# Altium project Q7.PrjPcb
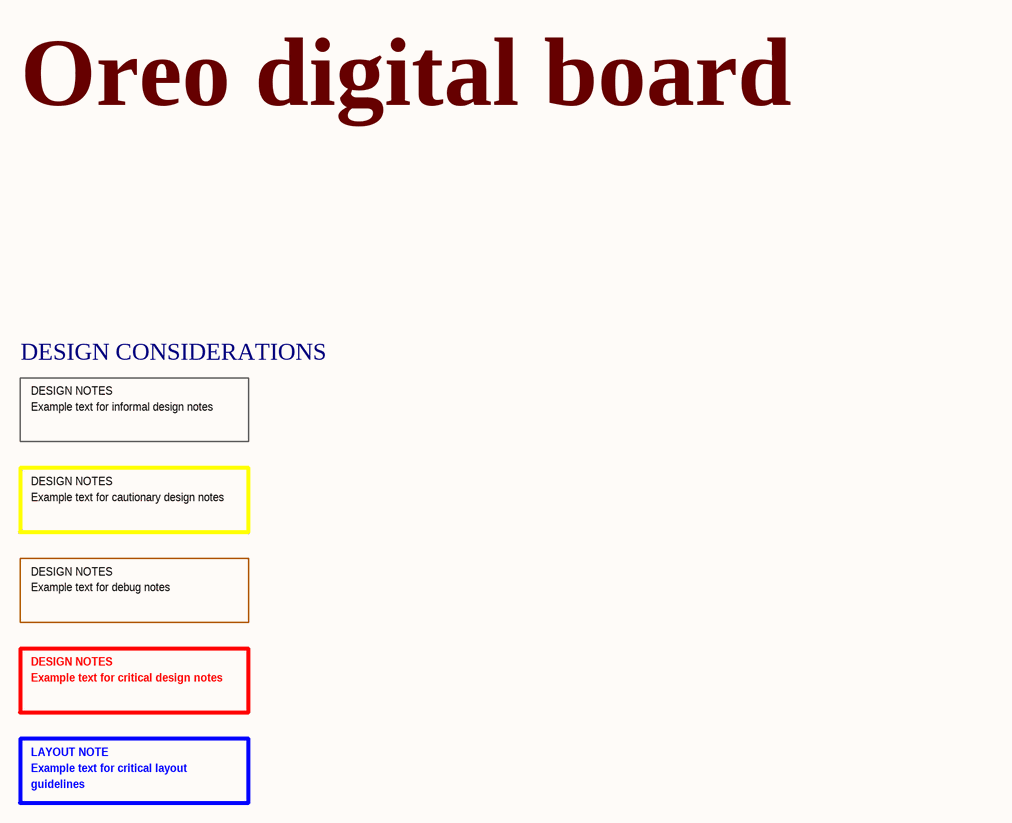
[diagram p0: [01] - COVER PAGE.SchDoc]
9 sheets, 124 parts. Net scope: flat (ports and power ports of the same name join across sheets).
Board file: Q7.PcbDoc
Sheets:
  [01] - COVER PAGE.SchDoc
  [02] - CPU - IO.SchDoc
  [03] - CPU - SIGNAL, USB, JTAG.SchDoc
  [04] - CPU - POWER.SchDoc
  [05] - AUDIO.SchDoc
  [06] - BUTTONS - LEDS.SchDoc
  [07] - POWER.SchDoc
  [08] - CONNECTORS.SchDoc
  [09] - FTDI.SchDoc

## Sheet [01] - COVER PAGE.SchDoc: COVER PAGE
size A4; Organization: Bjørn Brodtkorb; Address1: Frode Rinnans veg 161; Address2: 7050 Trondheim; DocumentNumber: 6598; Revision: 1.0; SheetNumber: 1; SheetTotal: 1

### Notes on the sheet
- Oreo digital board
- DESIGN CONSIDERATIONS
- DESIGN NOTES
- Example text for informal design notes
- Example text for cautionary design notes
- Example text for debug notes
- Example text for critical design notes
- LAYOUT NOTE
- Example text for critical layout
- guidelines
- Title
- Size:
- Date:
- A4
- Number:
- Time:
- Revision:
- Sheet
- of
- File:

## Sheet [02] - CPU - IO.SchDoc: Project
size A4; Organization: Tor Brodtkorb; Address1: Frode Rinnans veg 193; Address2: 7050 Trondheim; DocumentNumber: 6598; Revision: 1.0; SheetNumber: 1; SheetTotal: 1
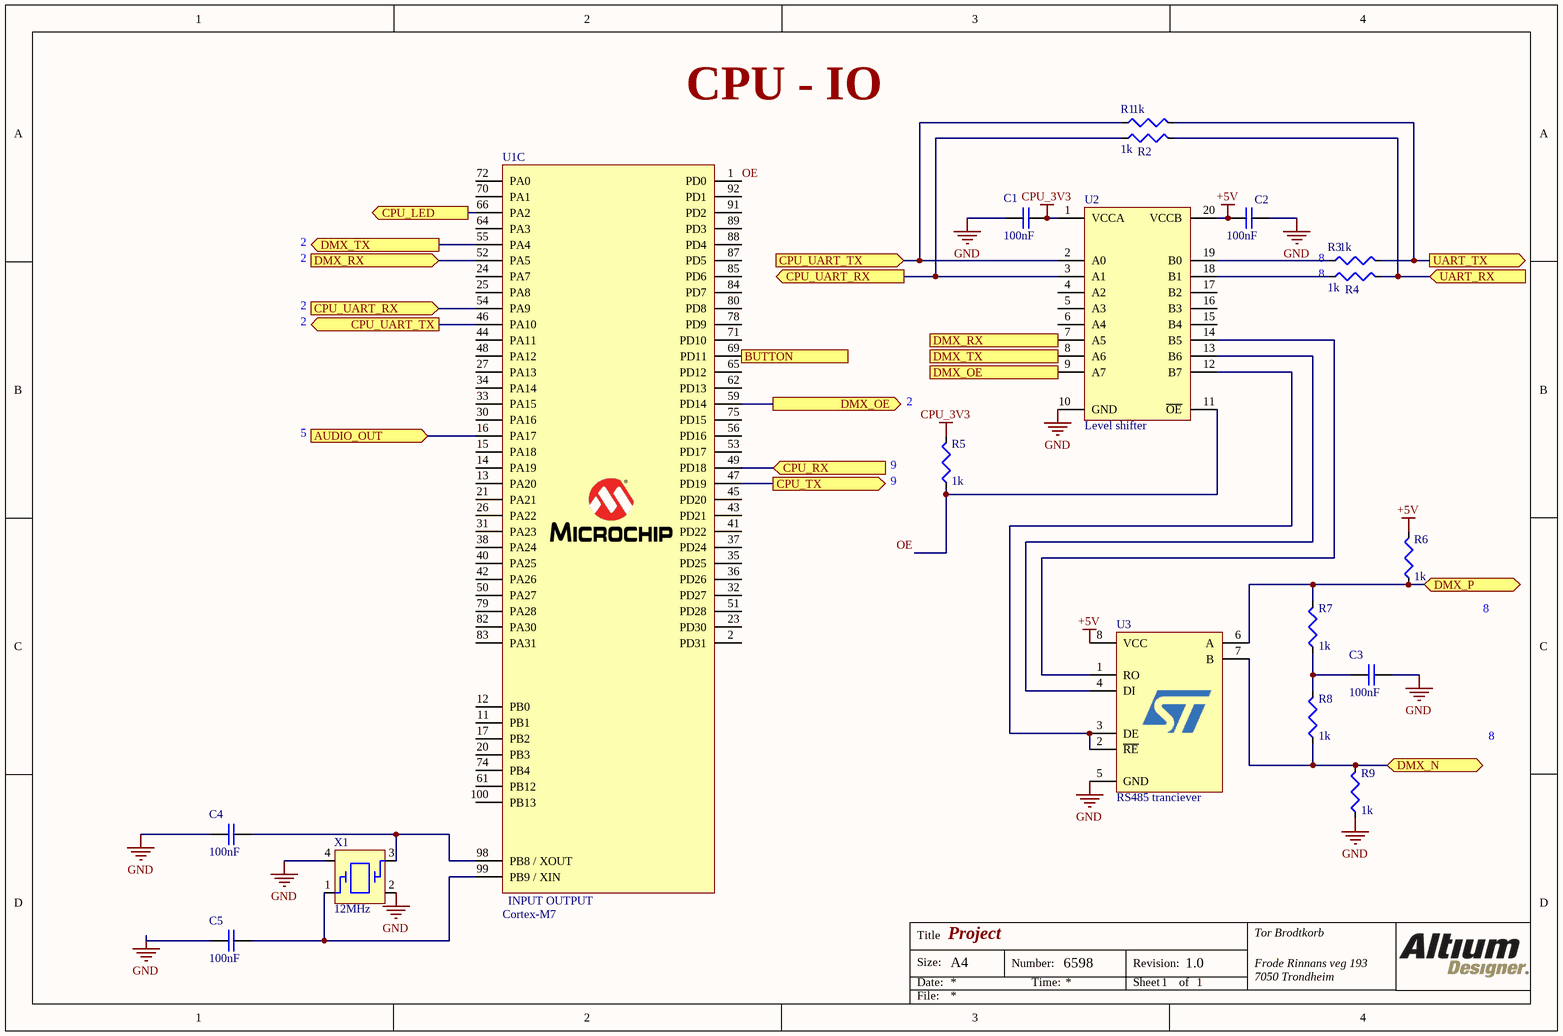
[diagram p1: [02] - CPU - IO.SchDoc]

### Parts
C1  value 100nF  [C0603]  (hidden comment: 02016D104KAT2A)
C2  value 100nF  [C0603]  (hidden comment: 02016D104KAT2A)
C3  value 100nF  [C0603]  (hidden comment: 02016D104KAT2A)
C4  value 100nF  [C0603]  (hidden comment: 02016D104KAT2A)
C5  value 100nF  [C0603]  (hidden comment: 02016D104KAT2A)
R1  value 1k  [R0603]  (hidden comment: CPF-A-0603B100KE1)
R2  value 1k  [R0603]  (hidden comment: CPF-A-0603B100KE1)
R3  value 1k  [R0603]  (hidden comment: CPF-A-0603B100KE1)
R4  value 1k  [R0603]  (hidden comment: CPF-A-0603B100KE1)
R5  value 1k  [R0603]  (hidden comment: CPF-A-0603B100KE1)
R6  value 1k  [R0603]  (hidden comment: CPF-A-0603B100KE1)
R7  value 1k  [R0603]  (hidden comment: CPF-A-0603B100KE1)
R8  value 1k  [R0603]  (hidden comment: CPF-A-0603B100KE1)
R9  value 1k  [R0603]  (hidden comment: CPF-A-0603B100KE1)
U1  Cortex-M7  [ATSAMS70N19A-AN]  (part C of 3)
U2  Level shifter  [FXMA108BQX]
U3  RS485 tranciever  [ST485CDR]
X1  12MHz  [MCSJK-7U-12.00-12-30-80-B-30]

### Ports
AUDIO_OUT (in), BUTTON (in), CPU_LED (out), CPU_RX (in), CPU_TX (out), CPU_UART_RX (in), CPU_UART_RX (out), CPU_UART_TX (in), CPU_UART_TX (out), DMX_N (bidir), DMX_OE (in), DMX_OE (out), DMX_P (bidir), DMX_RX (in), DMX_RX (out), DMX_TX (in), DMX_TX (out), UART_RX (in), UART_TX (out)

### Nets
+5V: C2.2 R6.2 U2.20(VCCB) U3.8(VCC)
CPU_3V3: C1.2 R5.2 U2.1(VCCA)  [project net +3V3]
GND: C1.1 C2.1 C3.1 C4.1 C5.1 R9.1 U2.10(GND) U3.5(GND) X1.2 X1.4
OE: R5.1 U1.1(PD0) U2.11(~{OE})
NetC3_2: C3.2 R7.1 R8.2
NetC4_2: C4.2 U1.98(PB8_/_XOUT) X1.3
NetC5_2: C5.2 U1.99(PB9_/_XIN) X1.1
NetC49_2: U1.16(PA17) ; port AUDIO_OUT
NetJ5_1: R6.1 R7.2 U3.6(A) ; port DMX_P
NetJ5_2: R8.1 R9.2 U3.7(B) ; port DMX_N
NetJ6_1: R1.2 R3.2 ; port UART_TX
NetJ6_2: R2.2 R4.2 ; port UART_RX
NetR1_1: R1.1 U1.46(PA10) U2.2(A0) ; port CPU_UART_TX
NetR2_1: R2.1 U1.54(PA9) U2.3(A1) ; port CPU_UART_RX
NetR3_1: R3.1 U2.19(B0)
NetR4_1: R4.1 U2.18(B1)
NetR25_1: U1.66(PA2) ; port CPU_LED
NetSW1_1: U1.69(PD11) ; port BUTTON
NetU1_47: U1.47(PD19) ; port CPU_TX
NetU1_49: U1.49(PD18) ; port CPU_RX
NetU1_52: U1.52(PA5) U2.7(A5) ; port DMX_RX
NetU1_55: U1.55(PA4) U2.8(A6) ; port DMX_TX
NetU1_59: U1.59(PD14) U2.9(A7) ; port DMX_OE
NetU2_12: U2.12(B7) U3.2(~{RE}) U3.3(DE)
NetU2_13: U2.13(B6) U3.4(DI)
NetU2_14: U2.14(B5) U3.1(RO)

Not connected (* = marked no-connect by the designer): U1 2(PD31) 11(PB1) 12(PB0) 13(PA20) 14(PA19) 15(PA18) 17(PB2) 20(PB3) 21(PA21) 23(PD30) 24(PA7) 25(PA8) 26(PA22) 27(PA13) 30(PA16) 31(PA23) 32(PD27) 33(PA15) 34(PA14) 35(PD25) 36(PD26) 37(PD24) 38(PA24) 40(PA25) 41(PD22) 42(PA26) 43(PD21) 44(PA11) 45(PD20) 48(PA12) 50(PA27) 51(PD28) 53(PD17) 56(PD16) 61(PB12) 62(PD13) 64(PA3) 65(PD12) 70(PA1) 71(PD10) 72(PA0) 74(PB4) 75(PD15) 78(PD9) 79(PA28) 80(PD8) 82(PA30) 83(PA31) 84(PD7) 85(PD6) 87(PD5) 88(PD4) 89(PD3) 91(PD2) 92(PD1) 100(PB13); U2 4(A2) 5(A3) 6(A4) 15(B4) 16(B3) 17(B2)

### Notes on the sheet
- CPU - IO
- 2
- (near R3) 8
- 8
- 5
- (near R5) 2
- (near R5) 9
- Title
- Size:
- Date:
- A4
- Number:
- Time:
- Revision:
- Sheet
- of
- File:
- (in symbol ATSAMS70N19A-AN, part C) INPUT OUTPUT

### Library data of the parts
C1-C5 = 02016D104KAT2A: C0603
R1-R9 = CPF-A-0603B100KE1: R0603
U1 = ATSAMS70N19A-AN: ATSAMS70N19
U2 = FXMA108BQX: 8-bit bidirectional level shifter
U3 = ST485CDR
X1 = MCSJK-7U-12.00-12-30-80-B-30: Crystal 12MHz 3.2mm x 2.5mm

## Sheet [03] - CPU - SIGNAL, USB, JTAG.SchDoc: Project
size A4; Organization: Tor Brodtkorb; Address1: Frode Rinnans veg 193; Address2: 7050 Trondheim; DocumentNumber: 6598; Revision: 1.0; SheetNumber: 1; SheetTotal: 1
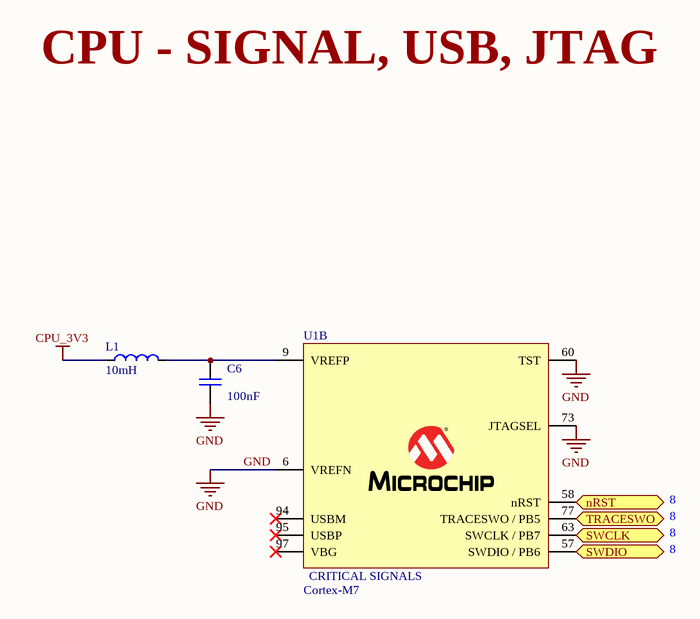
[diagram p2: [03] - CPU - SIGNAL, USB, JTAG.SchDoc]

### Parts
C6  value 100nF  [C0603]  (hidden comment: 02016D104KAT2A)
L1  value 10mH  [Inductor 0603]  (hidden comment: MLZ1608A2R2WT)
U1  Cortex-M7  [ATSAMS70N19A-AN]  (part B of 3)

### Ports
nRST (bidir), SWCLK (bidir), SWDIO (bidir), TRACESWO (bidir)

### Nets
CPU_3V3: L1.1  [project net +3V3]
GND: C6.1 U1.6(VREFN) U1.60(TST) U1.73(JTAGSEL)
NetC6_2: C6.2 L1.2 U1.9(VREFP)
NetJ7_2: U1.58(nRST) ; port nRST
NetJ7_6: U1.77(TRACESWO_/_PB5) ; port TRACESWO
NetJ7_8: U1.63(SWCLK_/_PB7) ; port SWCLK
NetJ7_10: U1.57(SWDIO_/_PB6) ; port SWDIO

Not connected (* = marked no-connect by the designer): U1 94(USBM)* 95(USBP)* 97(VBG)*

### Notes on the sheet
- CPU - SIGNAL, USB, JTAG
- 8
- Title
- Size:
- Date:
- A4
- Number:
- Time:
- Revision:
- Sheet
- of
- File:
- (in symbol ATSAMS70N19A-AN, part B) CRITICAL SIGNALS

### Library data of the parts
C6 = 02016D104KAT2A: C0603
L1 = MLZ1608A2R2WT: Inductor 0603
U1 = ATSAMS70N19A-AN: ATSAMS70N19

## Sheet [04] - CPU - POWER.SchDoc: Project
size A4; Organization: Tor Brodtkorb; Address1: Frode Rinnans veg 193; Address2: 7050 Trondheim; DocumentNumber: 6598; Revision: 1.0; SheetNumber: 1; SheetTotal: 1
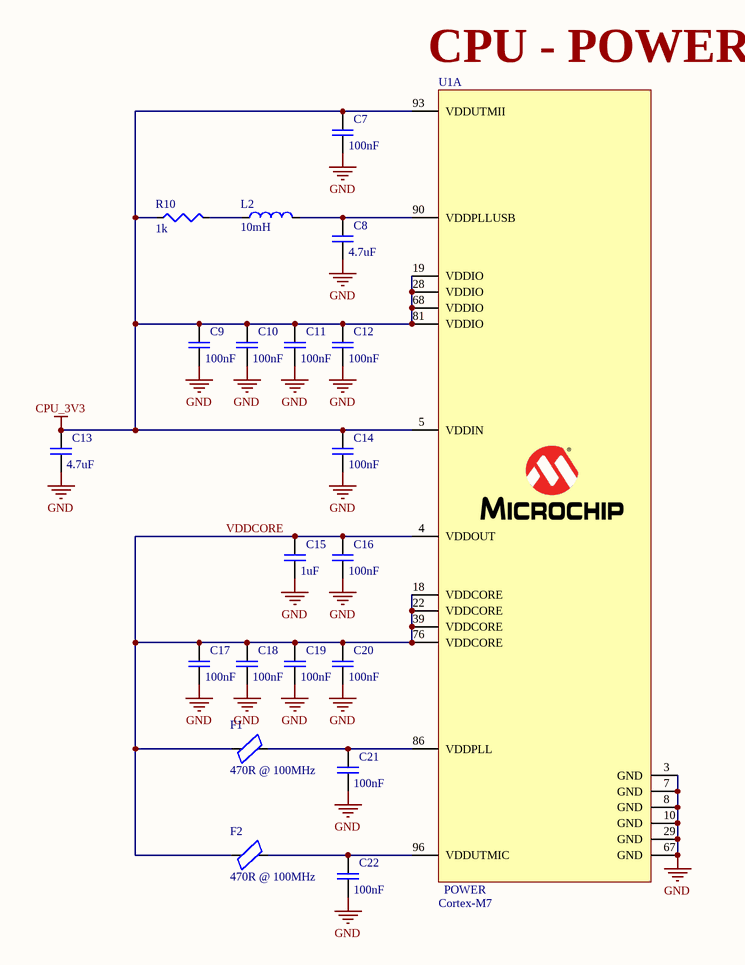
[diagram p3: [04] - CPU - POWER.SchDoc]

### Parts
C7  value 100nF  [C0603]  (hidden comment: 02016D104KAT2A)
C8  value 4.7uF  [C0603]  (hidden comment: 02016D104KAT2A)
C9  value 100nF  [C0603]  (hidden comment: 02016D104KAT2A)
C10  value 100nF  [C0603]  (hidden comment: 02016D104KAT2A)
C11  value 100nF  [C0603]  (hidden comment: 02016D104KAT2A)
C12  value 100nF  [C0603]  (hidden comment: 02016D104KAT2A)
C13  value 4.7uF  [C0603]  (hidden comment: 02016D104KAT2A)
C14  value 100nF  [C0603]  (hidden comment: 02016D104KAT2A)
C15  value 1uF  [C0603]  (hidden comment: 02016D104KAT2A)
C16  value 100nF  [C0603]  (hidden comment: 02016D104KAT2A)
C17  value 100nF  [C0603]  (hidden comment: 02016D104KAT2A)
C18  value 100nF  [C0603]  (hidden comment: 02016D104KAT2A)
C19  value 100nF  [C0603]  (hidden comment: 02016D104KAT2A)
C20  value 100nF  [C0603]  (hidden comment: 02016D104KAT2A)
C21  value 100nF  [C0603]  (hidden comment: 02016D104KAT2A)
C22  value 100nF  [C0603]  (hidden comment: 02016D104KAT2A)
F1  value 470R @ 100MHz  [Ferrite bead 0603]  (hidden comment: BLM18AG121SN1D)
F2  value 470R @ 100MHz  [Ferrite bead 0603]  (hidden comment: BLM18AG121SN1D)
L2  value 10mH  [Inductor 0603]  (hidden comment: MLZ1608A2R2WT)
R10  value 1k  [R0603]  (hidden comment: CPF-A-0603B100KE1)
U1  Cortex-M7  [ATSAMS70N19A-AN]  (part A of 3)

### Nets
CPU_3V3: C7.2 C9.2 C10.2 C11.2 C12.2 C13.2 C14.2 R10.1 U1.5(VDDIN) U1.19(VDDIO) U1.28(VDDIO) U1.68(VDDIO) U1.81(VDDIO) U1.93(VDDUTMII)  [project net +3V3]
GND: C7.1 C8.1 C9.1 C10.1 C11.1 C12.1 C13.1 C14.1 C15.1 C16.1 C17.1 C18.1 C19.1 C20.1 C21.1 C22.1 U1.3(GND) U1.7(GND) U1.8(GND) U1.10(GND) U1.29(GND) U1.67(GND)
VDDCORE: C15.2 C16.2 C17.2 C18.2 C19.2 C20.2 F1.1 F2.1 U1.4(VDDOUT) U1.18(VDDCORE) U1.22(VDDCORE) U1.39(VDDCORE) U1.76(VDDCORE)
NetC8_2: C8.2 L2.2 U1.90(VDDPLLUSB)
NetC21_2: C21.2 F1.2 U1.86(VDDPLL)
NetC22_2: C22.2 F2.2 U1.96(VDDUTMIC)
NetL2_1: L2.1 R10.2

### Notes on the sheet
- (near U1) CPU - POWER
- Title
- Size:
- Date:
- A4
- Number:
- Time:
- Revision:
- Sheet
- of
- File:
- (in symbol ATSAMS70N19A-AN, part A) POWER

### Library data of the parts
C7-C22 = 02016D104KAT2A: C0603
F1 F2 = BLM18AG121SN1D: Ferrite bead 0603
L2 = MLZ1608A2R2WT: Inductor 0603
R10 = CPF-A-0603B100KE1: R0603
U1 = ATSAMS70N19A-AN: ATSAMS70N19

## Sheet [05] - AUDIO.SchDoc: Project
size A4; Organization: Tor Brodtkorb; Address1: Frode Rinnans veg 193; Address2: 7050 Trondheim; DocumentNumber: 6598; Revision: 1.0; SheetNumber: 1; SheetTotal: 1
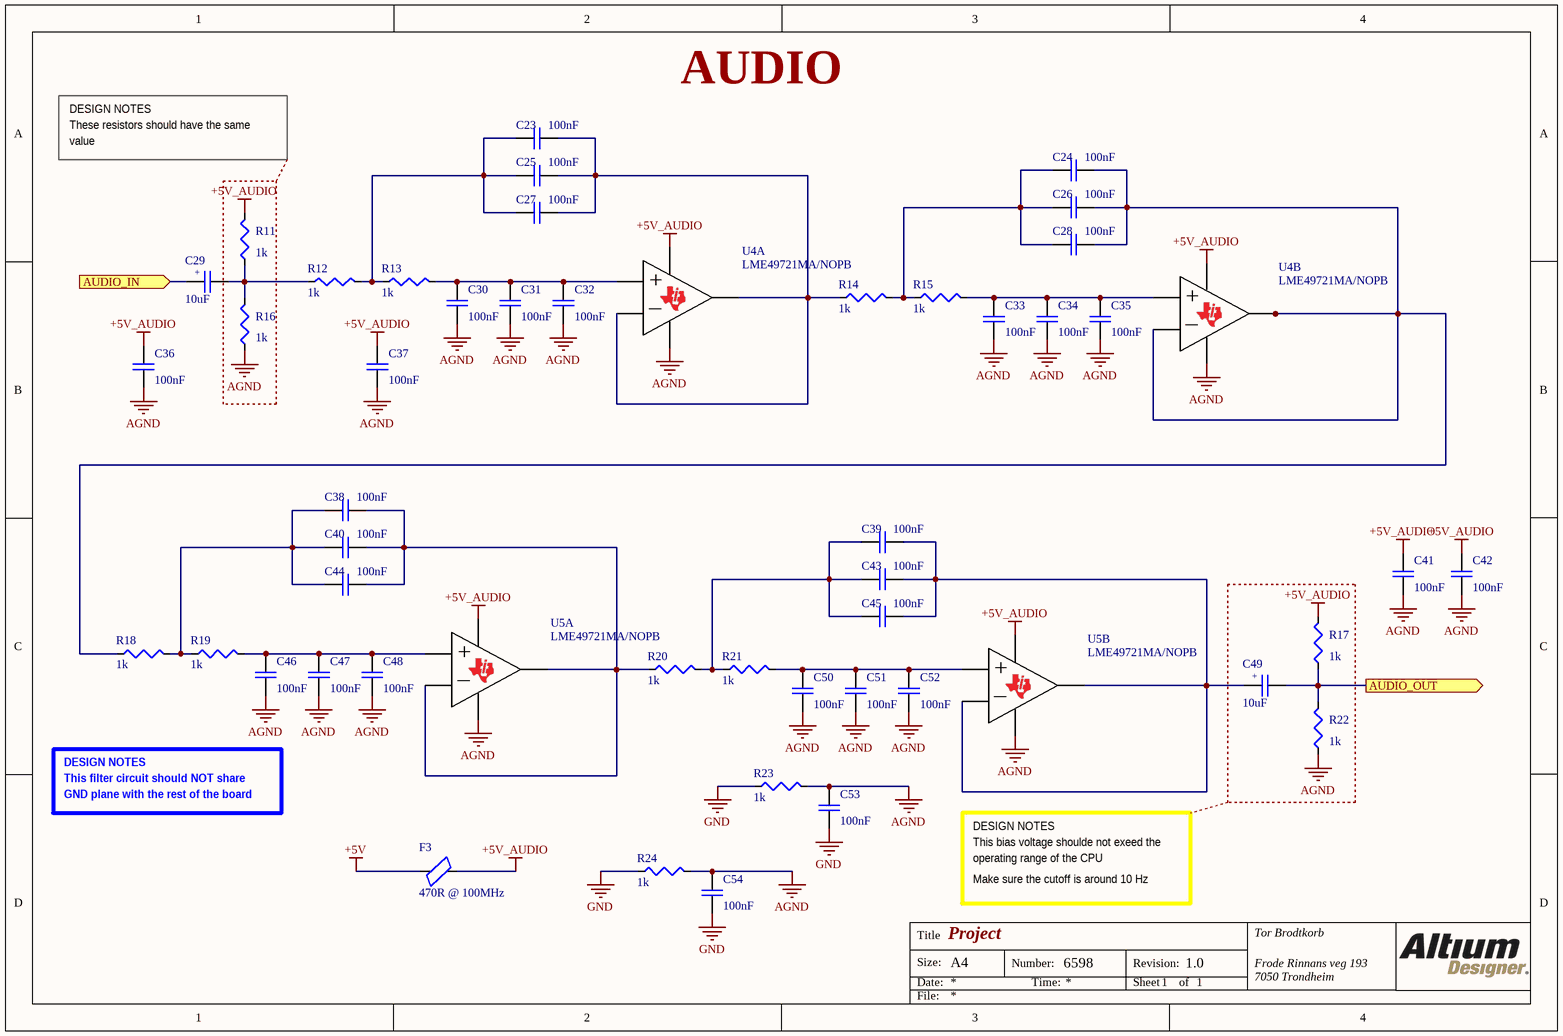
[diagram p4: [05] - AUDIO.SchDoc]

### Parts
C23  value 100nF  [C0603]  (hidden comment: 02016D104KAT2A)
C24  value 100nF  [C0603]  (hidden comment: 02016D104KAT2A)
C25  value 100nF  [C0603]  (hidden comment: 02016D104KAT2A)
C26  value 100nF  [C0603]  (hidden comment: 02016D104KAT2A)
C27  value 100nF  [C0603]  (hidden comment: 02016D104KAT2A)
C28  value 100nF  [C0603]  (hidden comment: 02016D104KAT2A)
C29  value 10uF  [Capacitor electrolytic SMD 4x5.4]  (hidden comment: EEE1HA2R2SR)
C30  value 100nF  [C0603]  (hidden comment: 02016D104KAT2A)
C31  value 100nF  [C0603]  (hidden comment: 02016D104KAT2A)
C32  value 100nF  [C0603]  (hidden comment: 02016D104KAT2A)
C33  value 100nF  [C0603]  (hidden comment: 02016D104KAT2A)
C34  value 100nF  [C0603]  (hidden comment: 02016D104KAT2A)
C35  value 100nF  [C0603]  (hidden comment: 02016D104KAT2A)
C36  value 100nF  [C0603]  (hidden comment: 02016D104KAT2A)
C37  value 100nF  [C0603]  (hidden comment: 02016D104KAT2A)
C38  value 100nF  [C0603]  (hidden comment: 02016D104KAT2A)
C39  value 100nF  [C0603]  (hidden comment: 02016D104KAT2A)
C40  value 100nF  [C0603]  (hidden comment: 02016D104KAT2A)
C41  value 100nF  [C0603]  (hidden comment: 02016D104KAT2A)
C42  value 100nF  [C0603]  (hidden comment: 02016D104KAT2A)
C43  value 100nF  [C0603]  (hidden comment: 02016D104KAT2A)
C44  value 100nF  [C0603]  (hidden comment: 02016D104KAT2A)
C45  value 100nF  [C0603]  (hidden comment: 02016D104KAT2A)
C46  value 100nF  [C0603]  (hidden comment: 02016D104KAT2A)
C47  value 100nF  [C0603]  (hidden comment: 02016D104KAT2A)
C48  value 100nF  [C0603]  (hidden comment: 02016D104KAT2A)
C49  value 10uF  [Capacitor electrolytic SMD 4x5.4]  (hidden comment: EEE1HA2R2SR)
C50  value 100nF  [C0603]  (hidden comment: 02016D104KAT2A)
C51  value 100nF  [C0603]  (hidden comment: 02016D104KAT2A)
C52  value 100nF  [C0603]  (hidden comment: 02016D104KAT2A)
C53  value 100nF  [C0603]  (hidden comment: 02016D104KAT2A)
C54  value 100nF  [C0603]  (hidden comment: 02016D104KAT2A)
F3  value 470R @ 100MHz  [Ferrite bead 0603]  (hidden comment: BLM18AG121SN1D)
R11  value 1k  [R0603]  (hidden comment: CPF-A-0603B100KE1)
R12  value 1k  [R0603]  (hidden comment: CPF-A-0603B100KE1)
R13  value 1k  [R0603]  (hidden comment: CPF-A-0603B100KE1)
R14  value 1k  [R0603]  (hidden comment: CPF-A-0603B100KE1)
R15  value 1k  [R0603]  (hidden comment: CPF-A-0603B100KE1)
R16  value 1k  [R0603]  (hidden comment: CPF-A-0603B100KE1)
R17  value 1k  [R0603]  (hidden comment: CPF-A-0603B100KE1)
R18  value 1k  [R0603]  (hidden comment: CPF-A-0603B100KE1)
R19  value 1k  [R0603]  (hidden comment: CPF-A-0603B100KE1)
R20  value 1k  [R0603]  (hidden comment: CPF-A-0603B100KE1)
R21  value 1k  [R0603]  (hidden comment: CPF-A-0603B100KE1)
R22  value 1k  [R0603]  (hidden comment: CPF-A-0603B100KE1)
R23  value 1k  [R0603]  (hidden comment: CPF-A-0603B100KE1)
R24  value 1k  [R0603]  (hidden comment: CPF-A-0603B100KE1)
U4  LME49721MA/NOPB  [LME49721MA/NOPB]  (parts A,B of 2)
U5  LME49721MA/NOPB  [LME49721MA/NOPB]  (parts A,B of 2)

### Ports
AUDIO_IN (in), AUDIO_OUT (out)

### Nets
+5V: F3.1
+5V_AUDIO: C36.2 C37.2 C41.2 C42.2 F3.2 R11.2 R17.2 U4.8(VDD) U5.8(VDD)
AGND: C30.1 C31.1 C32.1 C33.1 C34.1 C35.1 C36.1 C37.1 C41.1 C42.1 C46.1 C47.1 C48.1 C50.1 C51.1 C52.1 C53.2 C54.2 R16.1 R22.1 R23.2 R24.2 U4.4(VDD) U5.4(VDD)
GND: C53.1 C54.1 R23.1 R24.1
NetC23_1: C23.1 C25.1 C27.1 R12.2 R13.1
NetC23_2: C23.2 C25.2 C27.2 R14.1 U4.1(VDD) U4.2(VDD)
NetC24_1: C24.1 C26.1 C28.1 R14.2 R15.1
NetC24_2: C24.2 C26.2 C28.2 R18.1 U4.6(VDD) U4.7(VDD)
NetC29_1: C29.1 ; port AUDIO_IN
NetC29_2: C29.2 R11.1 R12.1 R16.2
NetC30_2: C30.2 C31.2 C32.2 R13.2 U4.3(VDD)
NetC33_2: C33.2 C34.2 C35.2 R15.2 U4.5(VDD)
NetC38_1: C38.1 C40.1 C44.1 R18.2 R19.1
NetC38_2: C38.2 C40.2 C44.2 R20.1 U5.1(VDD) U5.2(VDD)
NetC39_1: C39.1 C43.1 C45.1 R20.2 R21.1
NetC39_2: C39.2 C43.2 C45.2 C49.1 U5.6(VDD) U5.7(VDD)
NetC46_2: C46.2 C47.2 C48.2 R19.2 U5.3(VDD)
NetC49_2: C49.2 R17.1 R22.2 ; port AUDIO_OUT
NetC50_2: C50.2 C51.2 C52.2 R21.2 U5.5(VDD)

### Notes on the sheet
- DESIGN NOTES
- AUDIO
- These resistors should have the same
- value
- This filter circuit should NOT share
- GND plane with the rest of the board
- This bias voltage shoulde not exeed the
- operating range of the CPU
- Make sure the cutoff is around 10 Hz
- Title
- Size:
- Date:
- A4
- Number:
- Time:
- Revision:
- Sheet
- of
- File:
- (in symbol EEE1HA2R2SR) +
- (in symbol LME49721MA/NOPB, part A) +; _
- (in symbol LME49721MA/NOPB, part B) +; _

### Library data of the parts
C23-C28 C30-C48 C50-C54 = 02016D104KAT2A: C0603
C29 C49 = EEE1HA2R2SR: El. Capacitor SMD 4x5.4
F3 = BLM18AG121SN1D: Ferrite bead 0603
R11-R24 = CPF-A-0603B100KE1: R0603
U4 U5 = LME49721MA/NOPB: Audio OP amp, single supply, low voltage

## Sheet [06] - BUTTONS - LEDS.SchDoc: Project
size A4; Organization: Tor Brodtkorb; Address1: Frode Rinnans veg 193; Address2: 7050 Trondheim; DocumentNumber: 6598; Revision: 1.0; SheetNumber: 1; SheetTotal: 1
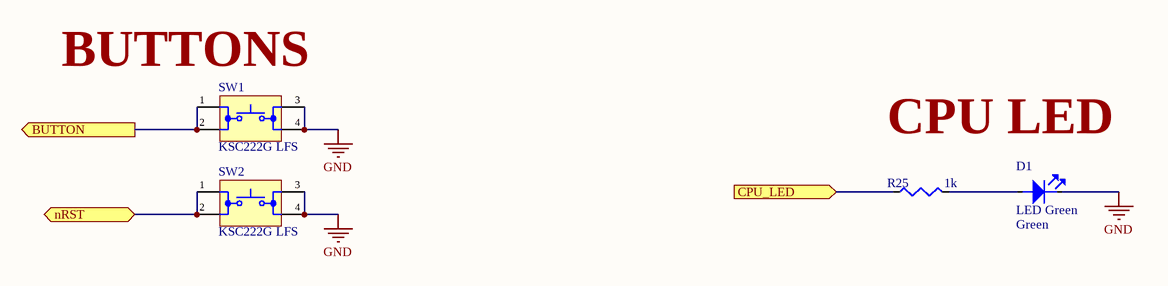
[diagram p5: [06] - BUTTONS - LEDS.SchDoc]

### Parts
D1  LED Green  Color: Green  [L0603 GREEN]
R25  value 1k  [R0603]  (hidden comment: CPF-A-0603B100KE1)
SW1  KSC222G LFS  [KSC222G LFS]
SW2  KSC222G LFS  [KSC222G LFS]

### Ports
BUTTON (out), CPU_LED (in), nRST (bidir)

### Nets
GND: D1.2 SW1.3 SW1.4 SW2.3 SW2.4
NetD1_1: D1.1 R25.2
NetJ7_2: SW2.1 SW2.2 ; port nRST
NetR25_1: R25.1 ; port CPU_LED
NetSW1_1: SW1.1 SW1.2 ; port BUTTON

### Notes on the sheet
- (near SW1) BUTTONS
- CPU LED
- Title
- Size:
- Date:
- A4
- Number:
- Time:
- Revision:
- Sheet
- of
- File:

### Library data of the parts
D1 = HSMG-C196: LED 0603 Green
R25 = CPF-A-0603B100KE1: R0603
SW1 SW2 = KSC222G LFS: Button SMD

## Sheet [07] - POWER.SchDoc: Project
size A4; Organization: Tor Brodtkorb; Address1: Frode Rinnans veg 193; Address2: 7050 Trondheim; DocumentNumber: 6598; Revision: 1.0; SheetNumber: 1; SheetTotal: 1
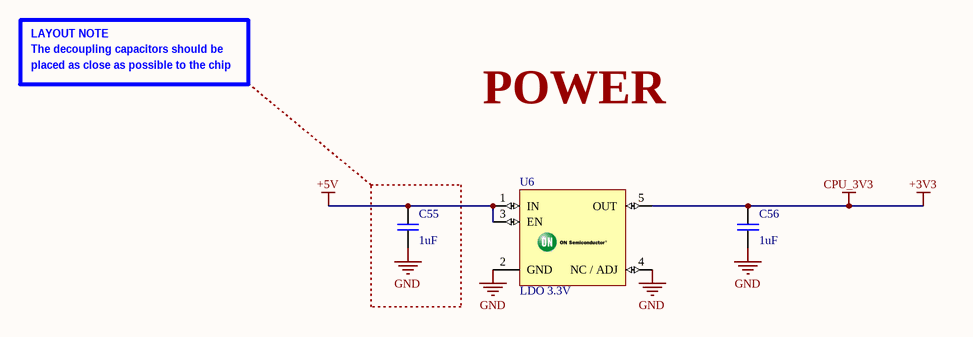
[diagram p6: [07] - POWER.SchDoc]

### Parts
C55  value 1uF  [C0603]  (hidden comment: 02016D104KAT2A)
C56  value 1uF  [C0603]  (hidden comment: 02016D104KAT2A)
U6  LDO 3.3V  [NCV8161BSN330T1G]

### Nets
+3V3: C56.2 U6.5(OUT)  [also labelled CPU_3V3]
+5V: C55.2 U6.1(IN) U6.3(EN)
GND: C55.1 C56.1 U6.2(GND) U6.4(NC_/_ADJ)

### Notes on the sheet
- LAYOUT NOTE
- The decoupling capacitors should be
- placed as close as possible to the chip
- POWER
- Title
- Size:
- Date:
- A4
- Number:
- Time:
- Revision:
- Sheet
- of
- File:

### Library data of the parts
C55 C56 = 02016D104KAT2A: C0603
U6 = NCV8161BSN330T1G: 3.3V fixed output LDO, < 10uVrms

## Sheet [08] - CONNECTORS.SchDoc: Project
size A4; Organization: Tor Brodtkorb; Address1: Frode Rinnans veg 193; Address2: 7050 Trondheim; DocumentNumber: 6598; Revision: 1.0; SheetNumber: 1; SheetTotal: 1
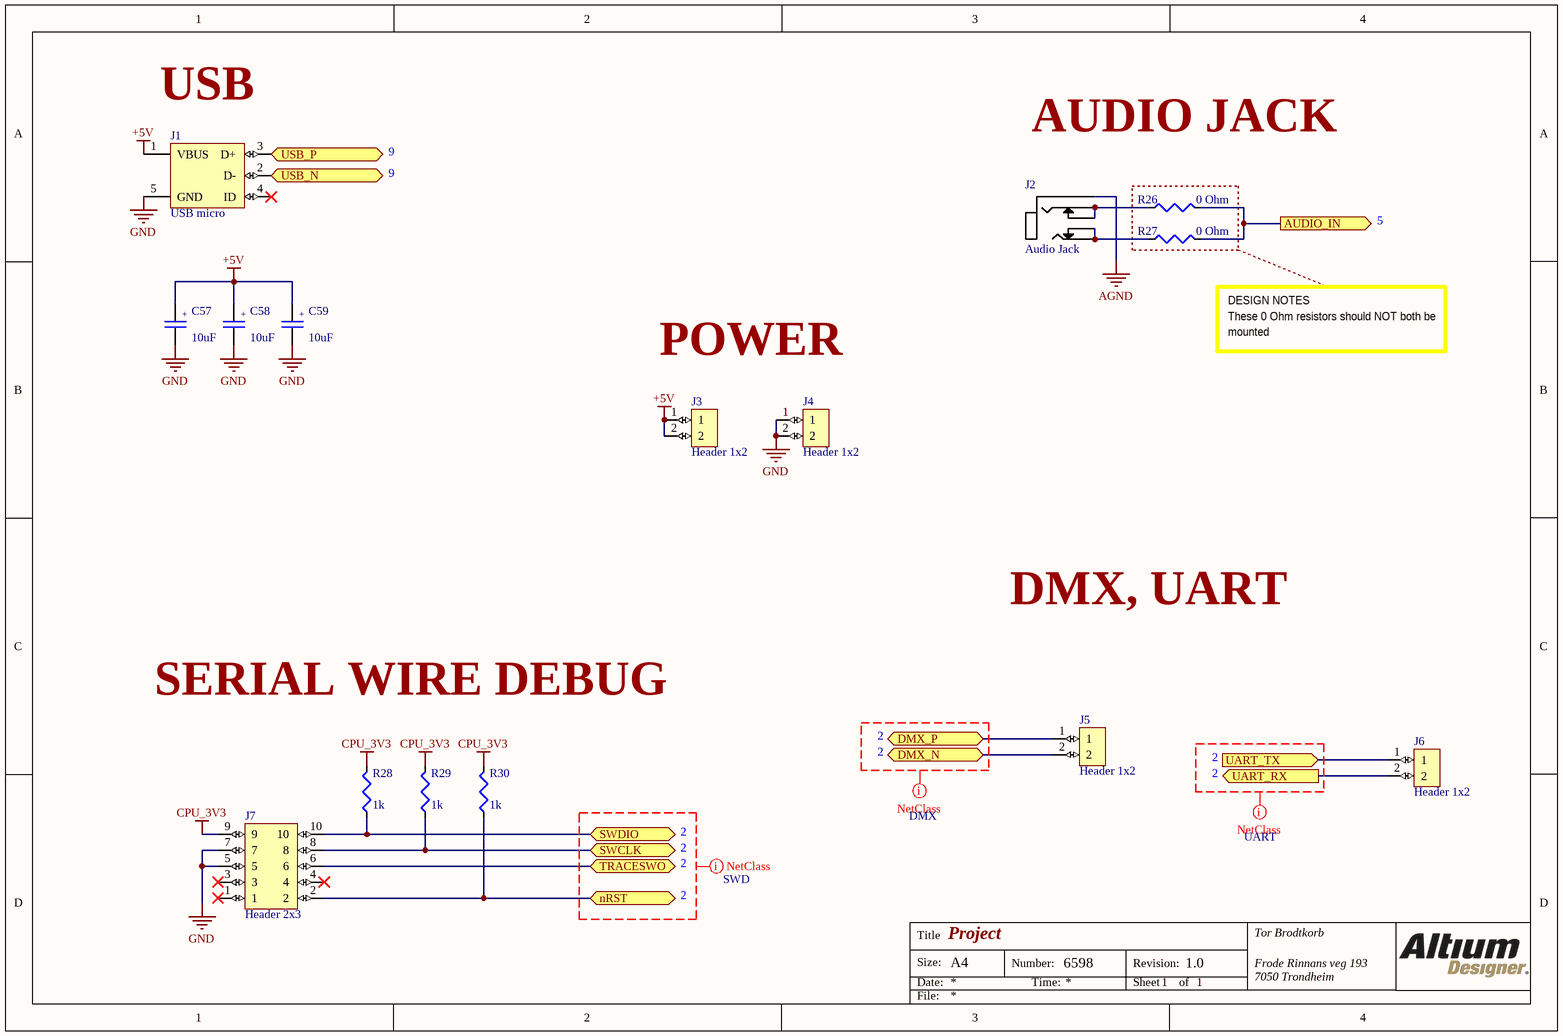
[diagram p7: [08] - CONNECTORS.SchDoc]

### Parts
C57  value 10uF  [Capacitor electrolytic SMD 4x5.4]  (hidden comment: EEE1HA2R2SR)
C58  value 10uF  [Capacitor electrolytic SMD 4x5.4]  (hidden comment: EEE1HA2R2SR)
C59  value 10uF  [Capacitor electrolytic SMD 4x5.4]  (hidden comment: EEE1HA2R2SR)
J1  USB micro  [USB micro]
J2  Audio Jack  [Audio jack flat]
J3  Header 1x2  [Header 1x2 2.54mm]
J4  Header 1x2  [Header 1x2 2.54mm]
J5  Header 1x2  [Header 1x2 2.54mm]
J6  Header 1x2  [Header 1x2 2.54mm]
J7  Header 2x3  [Header 2x5 1.27mm]
R26  value 0 Ohm  [R0603]  (hidden comment: CPF-A-0603B100KE1)
R27  value 0 Ohm  [R0603]  (hidden comment: CPF-A-0603B100KE1)
R28  value 1k  [R0603]  (hidden comment: CPF-A-0603B100KE1)
R29  value 1k  [R0603]  (hidden comment: CPF-A-0603B100KE1)
R30  value 1k  [R0603]  (hidden comment: CPF-A-0603B100KE1)

### Ports
AUDIO_IN (out), DMX_N (bidir), DMX_P (bidir), nRST (bidir), SWCLK (bidir), SWDIO (bidir), TRACESWO (bidir), UART_RX (out), UART_TX (in), USB_N (bidir), USB_P (bidir)

### Nets
+5V: C57.1 C58.1 C59.1 J1.1(VBUS) J3.1 J3.2
AGND: J2.1
CPU_3V3: J7.9 R28.2 R29.2 R30.2  [project net +3V3]
GND: C57.2 C58.2 C59.2 J1.5(GND) J4.1 J4.2 J7.5 J7.7
USB_N: J1.2(D-) ; port USB_N
USB_P: J1.3(D+) ; port USB_P
NetC29_1: R26.2 R27.2 ; port AUDIO_IN
NetJ2_2: J2.2 J2.3 R26.1
NetJ2_4: J2.4 J2.5 R27.1
NetJ5_1: J5.1 ; port DMX_P
NetJ5_2: J5.2 ; port DMX_N
NetJ6_1: J6.1 ; port UART_TX
NetJ6_2: J6.2 ; port UART_RX
NetJ7_2: J7.2 R30.1 ; port nRST
NetJ7_6: J7.6 ; port TRACESWO
NetJ7_8: J7.8 R29.1 ; port SWCLK
NetJ7_10: J7.10 R28.1 ; port SWDIO

Not connected (* = marked no-connect by the designer): J1 4(ID)*; J7 1* 3* 4*

### Layout directives
net class UART: (no net found under the mark)
net class DMX: (no net found under the mark)
net class SWD: (no net found under the mark)

### Notes on the sheet
- (near J1) USB
- 9
- AUDIO JACK
- 5
- DESIGN NOTES
- POWER
- These 0 Ohm resistors should NOT both be
- mounted
- DMX, UART
- SERIAL WIRE DEBUG
- 2
- Title
- Size:
- Date:
- A4
- Number:
- Time:
- Revision:
- Sheet
- of
- File:
- (in symbol EEE1HA2R2SR) +

### Library data of the parts
C57-C59 = EEE1HA2R2SR: El. Capacitor SMD 4x5.4
J1 = 47590-0001
J2 = FC68133: Audio jack flat 5 contacts
J3-J6 = M20-9990246: Header 1x2 2.54mm male
J7 = 20021111-00010T4LF: Header  2x5 1.27mm male
R26-R30 = CPF-A-0603B100KE1: R0603

## Sheet [09] - FTDI.SchDoc: USB
size A4; Organization: Tor Brodtkorb; Address1: Frode Rinnans veg 193; Address2: 7050 Trondheim; DocumentNumber: 6598; Revision: 1.0; SheetNumber: 1; SheetTotal: 1
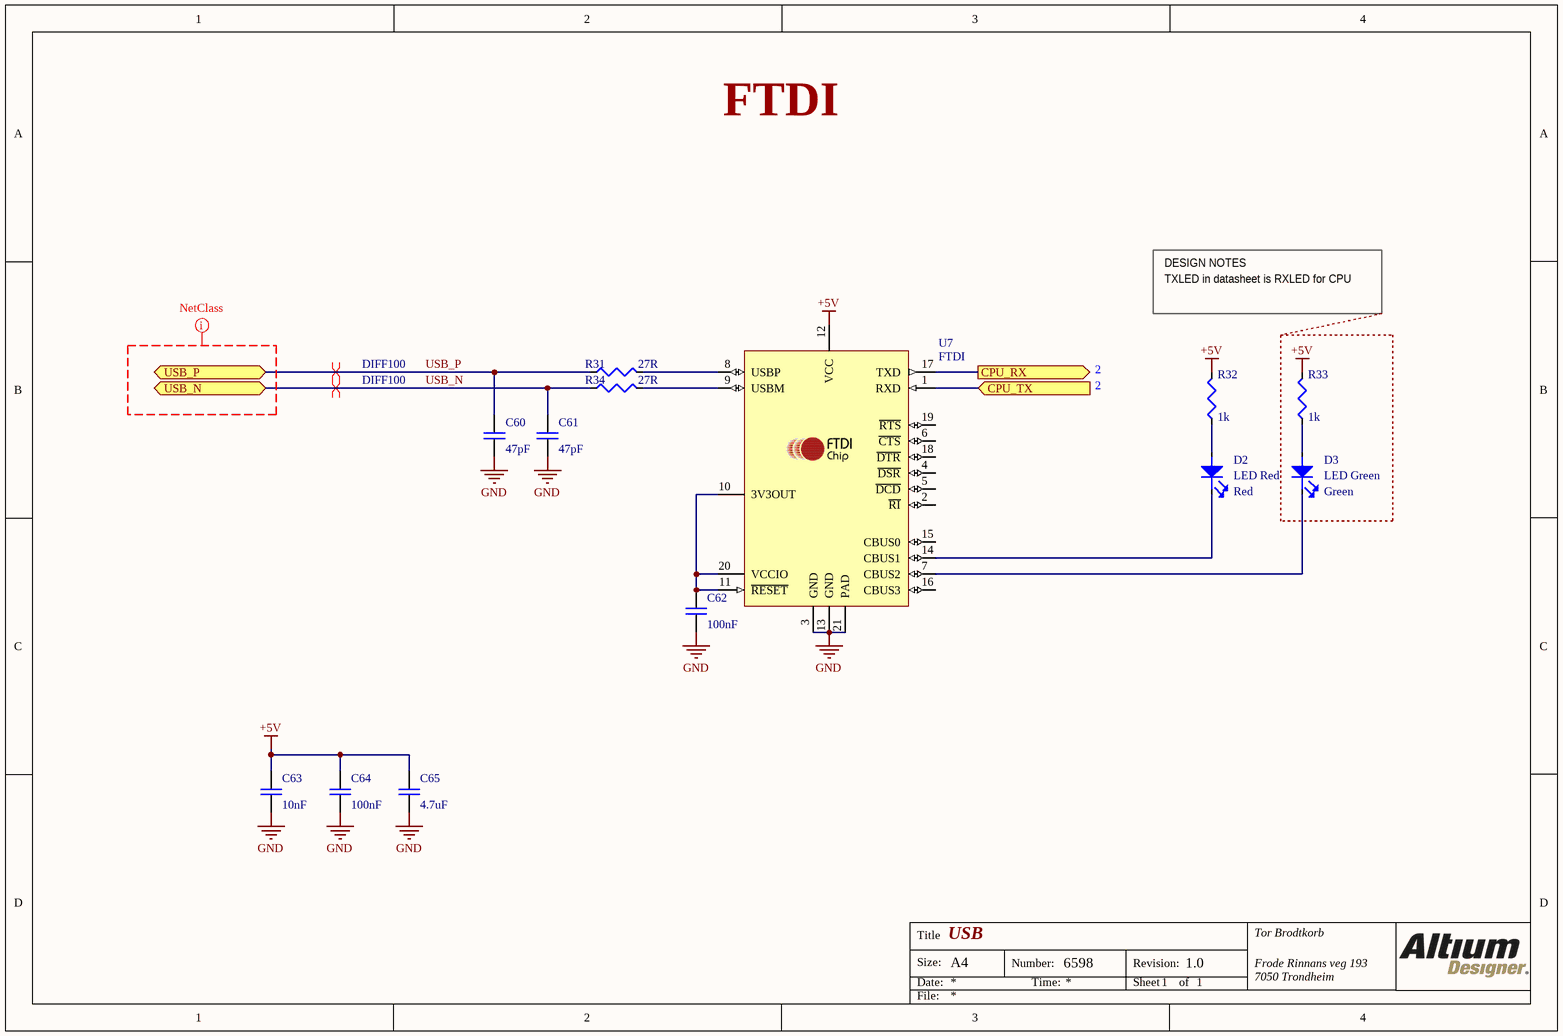
[diagram p8: [09] - FTDI.SchDoc]

### Parts
C60  value 47pF  [C0603]  (hidden comment: 02016D104KAT2A)
C61  value 47pF  [C0603]  (hidden comment: 02016D104KAT2A)
C62  value 100nF  [C0603]  (hidden comment: 02016D104KAT2A)
C63  value 10nF  [C0603]  (hidden comment: 02016D104KAT2A)
C64  value 100nF  [C0603]  (hidden comment: 02016D104KAT2A)
C65  value 4.7uF  [C0603]  (hidden comment: 02016D104KAT2A)
D2  LED Red  Color: Red  [L0603 RED]
D3  LED Green  Color: Green  [L0603 GREEN]
R31  value 27R  [R0603]  (hidden comment: CPF-A-0603B100KE1)
R32  value 1k  [R0603]  (hidden comment: CPF-A-0603B100KE1)
R33  value 1k  [R0603]  (hidden comment: CPF-A-0603B100KE1)
R34  value 27R  [R0603]  (hidden comment: CPF-A-0603B100KE1)
U7  FTDI  [FT231XQ-R]

### Ports
CPU_RX (out), CPU_TX (in), USB_N (bidir), USB_P (bidir)

### Nets
+5V: C63.2 C64.2 C65.2 R32.2 R33.2 U7.12(VCC)
GND: C60.1 C61.1 C62.1 C63.1 C64.1 C65.1 U7.3(GND) U7.13(GND) U7.21(PAD)
USB_N: C61.2 R34.1 ; port USB_N
USB_P: C60.2 R31.1 ; port USB_P
NetC62_2: C62.2 U7.10(3V3OUT) U7.11(~{RESET}) U7.20(VCCIO)
NetD2_1: D2.1 R32.1
NetD2_2: D2.2 U7.14(CBUS1)
NetD3_1: D3.1 R33.1
NetD3_2: D3.2 U7.7(CBUS2)
NetR31_2: R31.2 U7.8(USBP)
NetR34_2: R34.2 U7.9(USBM)
NetU1_47: U7.1(RXD) ; port CPU_TX
NetU1_49: U7.17(TXD) ; port CPU_RX

Not connected (* = marked no-connect by the designer): U7 2(~{RI}) 4(~{DSR}) 5(~{DCD}) 6(~{CTS}) 15(CBUS0) 16(CBUS3) 18(~{DTR}) 19(~{RTS})

### Layout directives
differential pair; differential pair class DIFF100: USB_N, USB_P
mark named NetClass: (no net found under the mark)

### Notes on the sheet
- FTDI
- DESIGN NOTES
- TXLED in datasheet is RXLED for CPU
- 2
- Title
- Size:
- Date:
- A4
- Number:
- Time:
- Revision:
- Sheet
- of
- File:

### Library data of the parts
C60-C65 = 02016D104KAT2A: C0603
D2 = HSMG-C190: LED 0603 Red
D3 = HSMG-C196: LED 0603 Green
R31-R34 = CPF-A-0603B100KE1: R0603
U7 = FT231XQ-R: UART to USB converter

## Nets that join several sheets
+3V3: [02] - CPU - IO (C1.2 R5.2 U2.1), [03] - CPU - SIGNAL, USB, JTAG (L1.1), [04] - CPU - POWER (14 pins), [07] - POWER (C56.2 U6.5), [08] - CONNECTORS (J7.9 R28.2 R29.2 R30.2)
+5V: [02] - CPU - IO (C2.2 R6.2 U2.20 U3.8), [05] - AUDIO (F3.1), [07] - POWER (C55.2 U6.1 U6.3), [08] - CONNECTORS (6 pins), [09] - FTDI (6 pins)
AGND: [05] - AUDIO (24 pins), [08] - CONNECTORS (J2.1)
GND: [02] - CPU - IO (10 pins), [03] - CPU - SIGNAL, USB, JTAG (C6.1 U1.6 U1.60 U1.73), [04] - CPU - POWER (22 pins), [05] - AUDIO (C53.1 C54.1 R23.1 R24.1), [06] - BUTTONS - LEDS (5 pins), [07] - POWER (C55.1 C56.1 U6.2 U6.4), [08] - CONNECTORS (8 pins), [09] - FTDI (9 pins)
NetC29_1: [05] - AUDIO (C29.1), [08] - CONNECTORS (R26.2 R27.2)
NetC49_2: [02] - CPU - IO (U1.16), [05] - AUDIO (C49.2 R17.1 R22.2)
NetJ5_1: [02] - CPU - IO (R6.1 R7.2 U3.6), [08] - CONNECTORS (J5.1)
NetJ5_2: [02] - CPU - IO (R8.1 R9.2 U3.7), [08] - CONNECTORS (J5.2)
NetJ6_1: [02] - CPU - IO (R1.2 R3.2), [08] - CONNECTORS (J6.1)
NetJ6_2: [02] - CPU - IO (R2.2 R4.2), [08] - CONNECTORS (J6.2)
NetJ7_2: [03] - CPU - SIGNAL, USB, JTAG (U1.58), [06] - BUTTONS - LEDS (SW2.1 SW2.2), [08] - CONNECTORS (J7.2 R30.1)
NetJ7_6: [03] - CPU - SIGNAL, USB, JTAG (U1.77), [08] - CONNECTORS (J7.6)
NetJ7_8: [03] - CPU - SIGNAL, USB, JTAG (U1.63), [08] - CONNECTORS (J7.8 R29.1)
NetJ7_10: [03] - CPU - SIGNAL, USB, JTAG (U1.57), [08] - CONNECTORS (J7.10 R28.1)
NetR25_1: [02] - CPU - IO (U1.66), [06] - BUTTONS - LEDS (R25.1)
NetSW1_1: [02] - CPU - IO (U1.69), [06] - BUTTONS - LEDS (SW1.1 SW1.2)
NetU1_47: [02] - CPU - IO (U1.47), [09] - FTDI (U7.1)
NetU1_49: [02] - CPU - IO (U1.49), [09] - FTDI (U7.17)
USB_N: [08] - CONNECTORS (J1.2), [09] - FTDI (C61.2 R34.1)
USB_P: [08] - CONNECTORS (J1.3), [09] - FTDI (C60.2 R31.1)